# Altium project RFMC.PrjPcb (part 1 of 2)
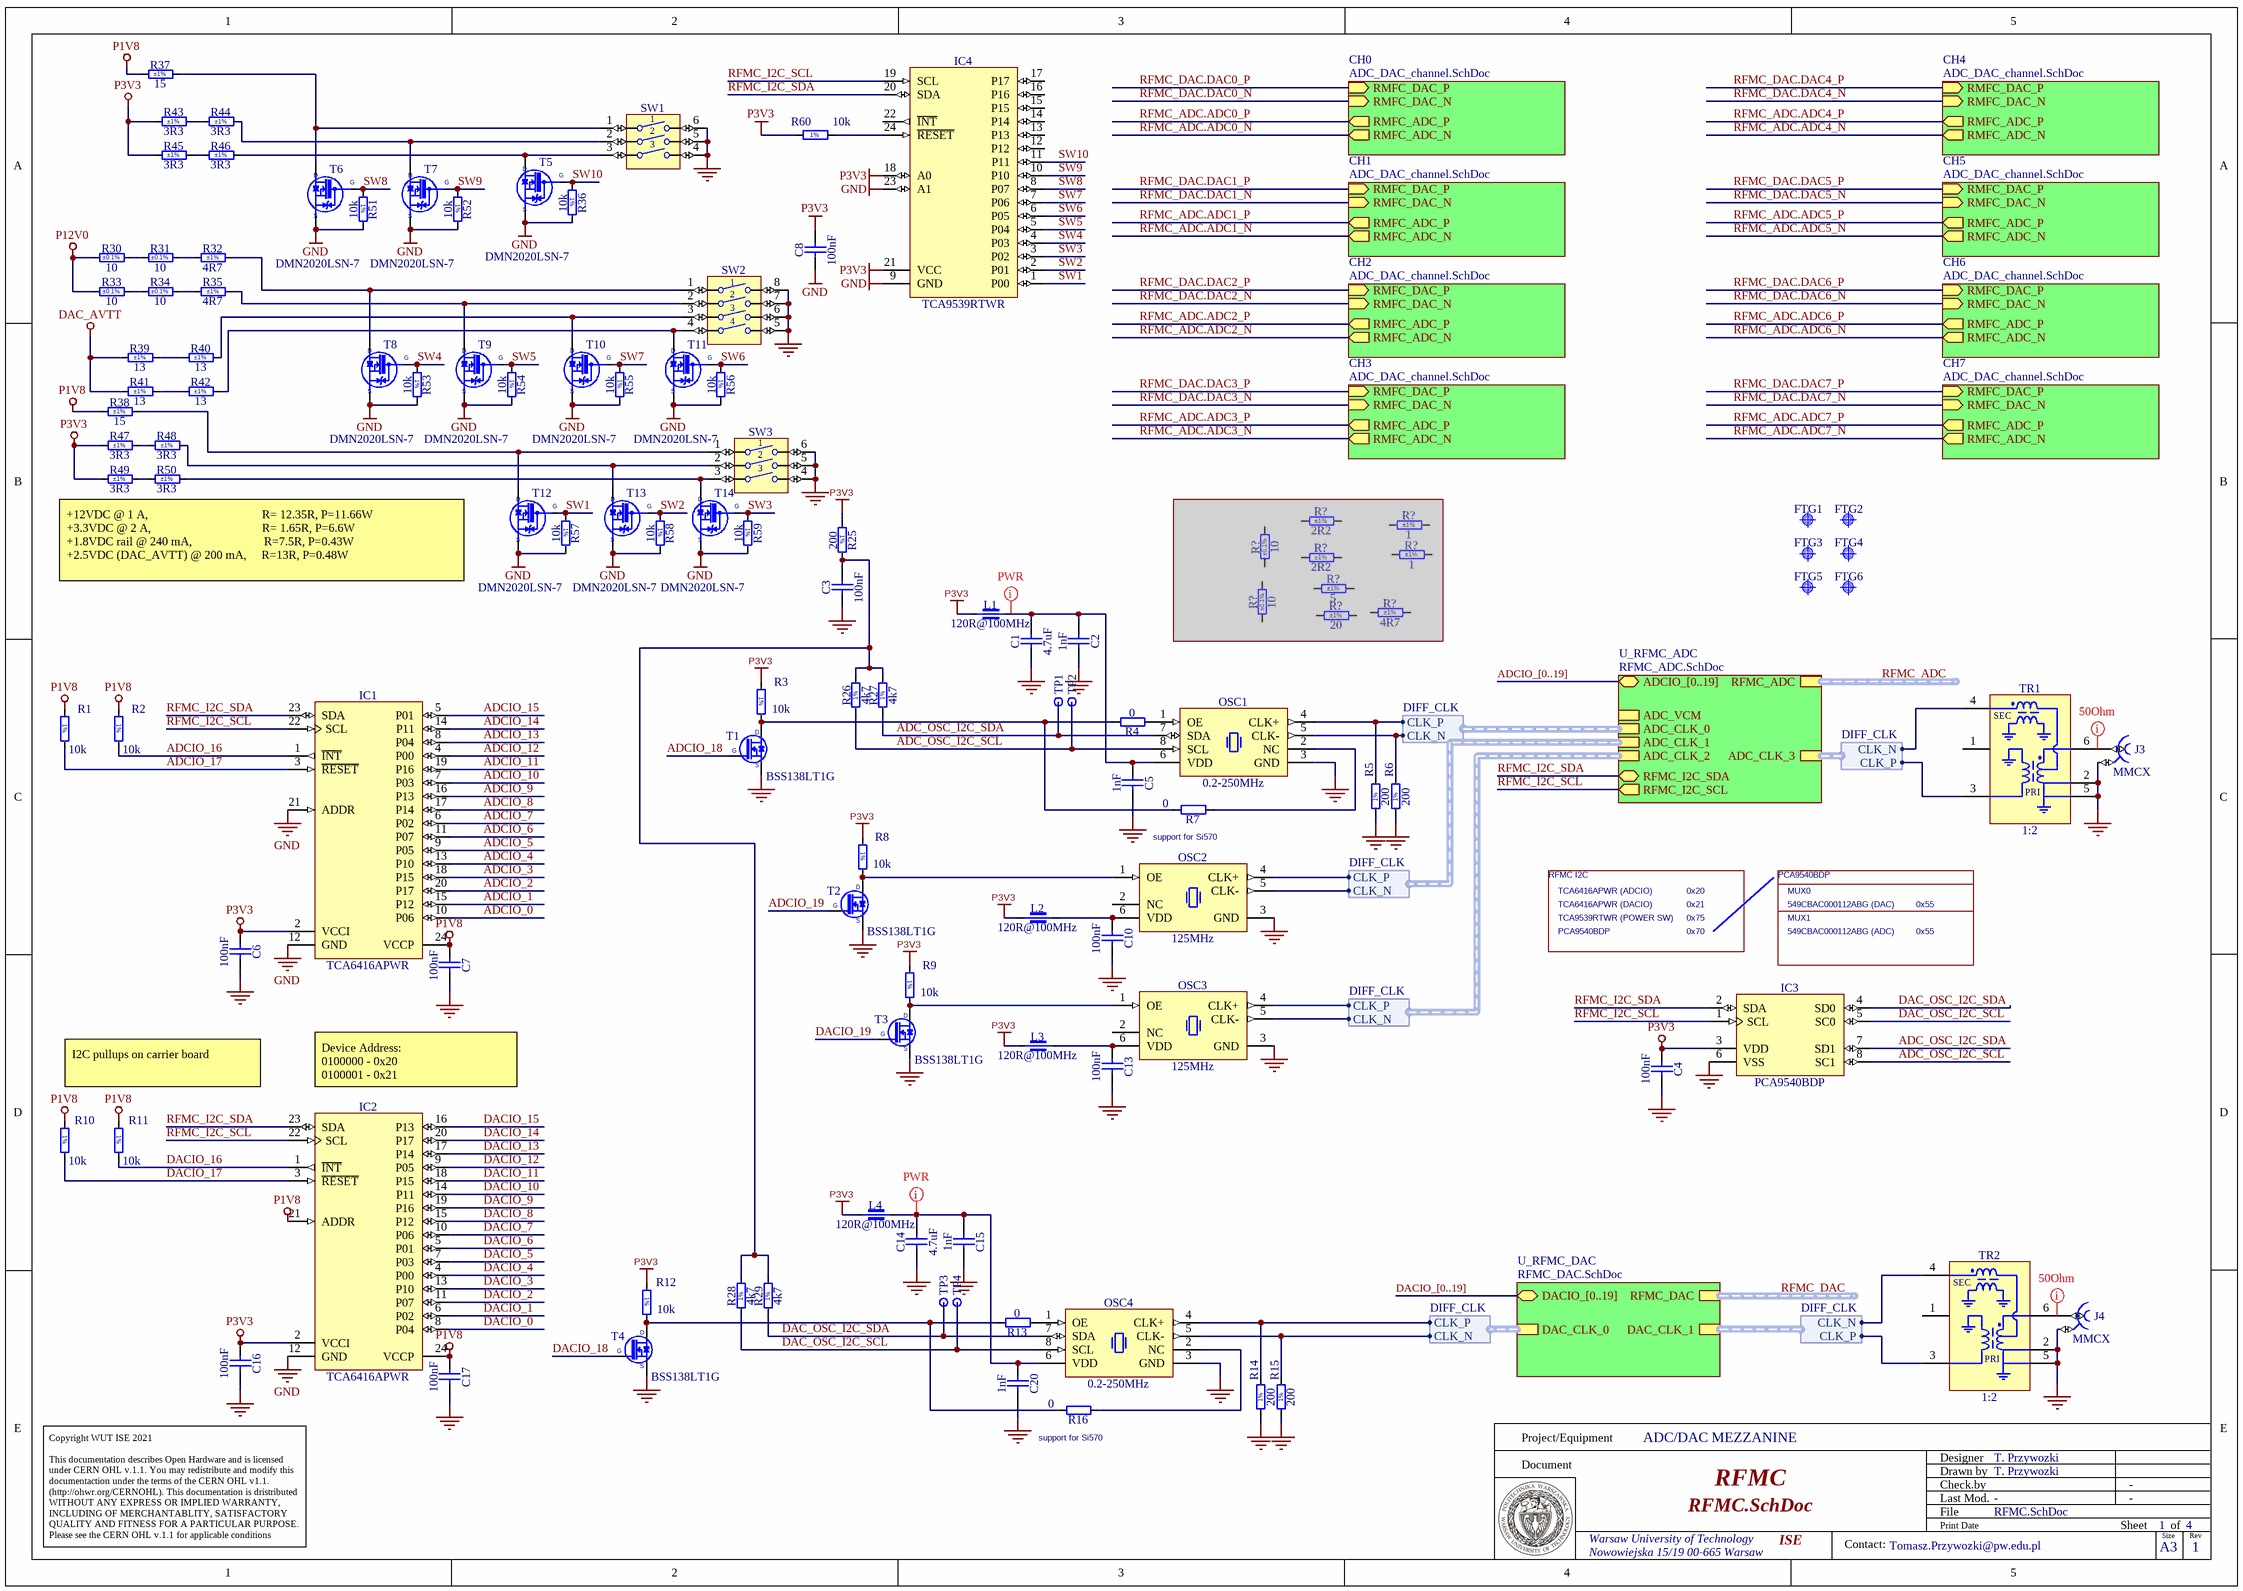
[diagram p0: RFMC.SchDoc]
4 sheets, 304 parts. Net scope: hierarchical (ports join the sheet entries above them; power ports are global).
Board file: RFMC.PcbDoc
Sheets:
  RFMC.SchDoc
    U_RFMC_ADC = RFMC_ADC.SchDoc
    U_RFMC_DAC = RFMC_DAC.SchDoc
    CH0 = ADC_DAC_channel.SchDoc
    CH1 = ADC_DAC_channel.SchDoc
    CH2 = ADC_DAC_channel.SchDoc
    CH3 = ADC_DAC_channel.SchDoc
    CH4 = ADC_DAC_channel.SchDoc
    CH5 = ADC_DAC_channel.SchDoc
    CH6 = ADC_DAC_channel.SchDoc
    CH7 = ADC_DAC_channel.SchDoc

## Sheet RFMC.SchDoc: RFMC
size 420 x 297 mm; Author: T. Przywozki; CompanyName: WUT; DrawnBy: T. Przywozki; Organization: WUT ISE; Address1: Warsaw University of Technology; Address2: Nowowiejska 15/19 00-665 Warsaw; Address3: Tomasz.Przywozki@pw.edu.pl; Revision: 1; SheetNumber: 1; SheetTotal: 4; Project: RFMC; ModifiedBy: -; CheckedDate: -; Title2: Title2; DivGrp: ISE; Designer: T. Przywozki; ModifiedDate: -; ProjectName: ADC/DAC MEZZANINE

### Parts
(Parts that share a designator on the sheet are numbered #1, #2 ... from top to bottom, then left to right.)
C1  4.7uF  [CAPC1608X90N]
C2  1nF  [CAPC0603X33N]
C3  100nF  [CAPC0603X33N]
C4  100nF  [CAPC0603X33N]
C5  1nF  [CAPC0603X33N]
C6  100nF  [CAPC0603X33N]
C7  100nF  [CAPC0603X33N]
C8  100nF  [CAPC1005X55N]
C10  100nF  [CAPC0603X33N]
C13  100nF  [CAPC0603X33N]
C14  4.7uF  [CAPC1608X90N]
C15  1nF  [CAPC0603X33N]
C16  100nF  [CAPC0603X33N]
C17  100nF  [CAPC0603X33N]
C20  1nF  [CAPC0603X33N]
FTG1  Use only in PCB  [FIDUCIAL_TOP_C100-200]  (value not drawn)
FTG2  Use only in PCB  [FIDUCIAL_TOP_S100-200]  (value not drawn)
FTG3  Use only in PCB  [FIDUCIAL_TOP_C100-200]  (value not drawn)
FTG4  Use only in PCB  [FIDUCIAL_TOP_S100-200]  (value not drawn)
FTG5  Use only in PCB  [FIDUCIAL_TOP_C100-200]  (value not drawn)
FTG6  Use only in PCB  [FIDUCIAL_TOP_S100-200]  (value not drawn)
IC1  TCA6416APWR  [SOP65P640X120-24N]
IC2  TCA6416APWR  [SOP65P640X120-24N]
IC3  PCA9540BDP  [SOP65P490X110-8N]
IC4  TCA9539RTWR  [QFN50P400X400X80-25N-S255]
J3  Family: MMCX  [HUBER-SUHNER_85_MMCX-50-0-1/111_OE]  (hidden comment: Coax_1Female_1Shield)
J4  Family: MMCX  [HUBER-SUHNER_85_MMCX-50-0-1/111_OE]  (hidden comment: Coax_1Female_1Shield)
L1  120R@100MHz  [INDC1608X95N]
L2  120R@100MHz  [INDC1608X95N]
L3  120R@100MHz  [INDC1608X95N]
L4  120R@100MHz  [INDC1608X95N]
OSC1  0.2-250MHz  [OSC_SILICON-LAB_SI549-A]
OSC2  125MHz  [OSC_SILICON-LAB_SI511-6N(3.2X5)]
OSC3  125MHz  [OSC_SILICON-LAB_SI511-6N(3.2X5)]
OSC4  0.2-250MHz  [OSC_SILICON-LAB_SI549-A]
R1  10k  [RESC1005X40N]
R2  10k  [RESC1005X40N]
R3  10k  [RESC1005X40N]
R4  0  [RESC1005X40N]
R5  200  [RESC1005X40N]
R6  200  [RESC1005X40N]
R7  0  [RESC1005X40N]
R8  10k  [RESC1005X40N]
R9  10k  [RESC1005X40N]
R10  10k  [RESC1005X40N]
R11  10k  [RESC1005X40N]
R12  10k  [RESC1005X40N]
R13  0  [RESC1005X40N]
R14  200  [RESC1005X40N]
R15  200  [RESC1005X40N]
R16  0  [RESC1005X40N]
R25  200  [RESC1005X40N]
R26  4k7  [RESC1005X40N]
R27  4k7  [RESC1005X40N]
R28  4k7  [RESC1005X40N]
R29  4k7  [RESC1005X40N]
R30  10  Tolerance: ±0.1%  [RESC6531X85N]
R31  10  Tolerance: ±0.1%  [RESC6531X85N]
R32  4R7  Tolerance: ±1%  [RESC6432X120N]
R33  10  Tolerance: ±0.1%  [RESC6531X85N]
R34  10  Tolerance: ±0.1%  [RESC6531X85N]
R35  4R7  Tolerance: ±1%  [RESC6432X120N]
R36  10k  [RESC1005X40N]
R37  15  Tolerance: ±1%  [RESC3216X65N]
R38  15  Tolerance: ±1%  [RESC3216X65N]
R39  13  Tolerance: ±1%  [RESC3216X65N]
R40  13  Tolerance: ±1%  [RESC3216X65N]
R41  13  Tolerance: ±1%  [RESC3216X65N]
R42  13  Tolerance: ±1%  [RESC3216X65N]
R43  3R3  Tolerance: ±1%  [RESC6331X70N]
R44  3R3  Tolerance: ±1%  [RESC6331X70N]
R45  3R3  Tolerance: ±1%  [RESC6331X70N]
R46  3R3  Tolerance: ±1%  [RESC6331X70N]
R47  3R3  Tolerance: ±1%  [RESC6331X70N]
R48  3R3  Tolerance: ±1%  [RESC6331X70N]
R49  3R3  Tolerance: ±1%  [RESC6331X70N]
R50  3R3  Tolerance: ±1%  [RESC6331X70N]
R51  10k  [RESC1005X40N]
R52  10k  [RESC1005X40N]
R53  10k  [RESC1005X40N]
R54  10k  [RESC1005X40N]
R55  10k  [RESC1005X40N]
R56  10k  [RESC1005X40N]
R57  10k  [RESC1005X40N]
R58  10k  [RESC1005X40N]
R59  10k  [RESC1005X40N]
R60  10k  [RESC1005X40N]
R?#1  2R2  Tolerance: ±1%  [RESC6432X120N]  (masked out: inside a compile mask, not in the netlist)
R?#2  1  Tolerance: ±1%  [RESC6331X70N]  (masked out: inside a compile mask, not in the netlist)
R?#3  1  Tolerance: ±1%  [RESC6331X70N]  (masked out: inside a compile mask, not in the netlist)
R?#4  2R2  Tolerance: ±1%  [RESC6432X120N]  (masked out: inside a compile mask, not in the netlist)
R?#5  10  Tolerance: ±0.1%  [RESC6531X85N]  (masked out: inside a compile mask, not in the netlist)
R?#6  5  Tolerance: ±1%  [RESM11670X449N]  (masked out: inside a compile mask, not in the netlist)
R?#7  20  Tolerance: ±1%  [RESC6432X120N]  (masked out: inside a compile mask, not in the netlist)
R?#8  4R7  Tolerance: ±1%  [RESC6331X70N]  (masked out: inside a compile mask, not in the netlist)
R?#9  10  Tolerance: ±0.1%  [RESC6531X85N]  (masked out: inside a compile mask, not in the netlist)
SW1  Switch  [SW_OMRON_A6SN-3101]  (value not drawn)
SW2  Switch  [SW_OMRON_A6SN-4101]  (value not drawn)
SW3  Switch  [SW_OMRON_A6SN-3101]  (value not drawn)
T1  BSS138LT1G  [SOT95P240X110-3N]
T2  BSS138LT1G  [SOT95P240X110-3N]
T3  BSS138LT1G  [SOT95P240X110-3N]
T4  BSS138LT1G  [SOT95P240X110-3N]
T5  DMN2020LSN-7  [SOT95P285X140-3N]
T6  DMN2020LSN-7  [SOT95P285X140-3N]
T7  DMN2020LSN-7  [SOT95P285X140-3N]
T8  DMN2020LSN-7  [SOT95P285X140-3N]
T9  DMN2020LSN-7  [SOT95P285X140-3N]
T10  DMN2020LSN-7  [SOT95P285X140-3N]
T11  DMN2020LSN-7  [SOT95P285X140-3N]
T12  DMN2020LSN-7  [SOT95P285X140-3N]
T13  DMN2020LSN-7  [SOT95P285X140-3N]
T14  DMN2020LSN-7  [SOT95P285X140-3N]
TP1  Test Point  [TPS127]  (value not drawn)
TP2  Test Point  [TPS127]  (value not drawn)
TP3  Test Point  [TPS127]  (value not drawn)
TP4  Test Point  [TPS127]  (value not drawn)
TR1  1:2  [XFMR_MINI-CIRCUITS_DB1627]
TR2  1:2  [XFMR_MINI-CIRCUITS_DB1627]

### Sub-sheets
CH0 = ADC_DAC_channel.SchDoc: RMFC_DAC_N (in), RMFC_DAC_P (in), RMFC_ADC_P (out), RMFC_ADC_N (out)
CH1 = ADC_DAC_channel.SchDoc: RMFC_DAC_N (in), RMFC_DAC_P (in), RMFC_ADC_P (out), RMFC_ADC_N (out)
CH2 = ADC_DAC_channel.SchDoc: RMFC_DAC_N (in), RMFC_DAC_P (in), RMFC_ADC_P (out), RMFC_ADC_N (out)
CH3 = ADC_DAC_channel.SchDoc: RMFC_DAC_N (in), RMFC_DAC_P (in), RMFC_ADC_P (out), RMFC_ADC_N (out)
CH4 = ADC_DAC_channel.SchDoc: RMFC_DAC_N (in), RMFC_DAC_P (in), RMFC_ADC_P (out), RMFC_ADC_N (out)
CH5 = ADC_DAC_channel.SchDoc: RMFC_DAC_N (in), RMFC_DAC_P (in), RMFC_ADC_P (out), RMFC_ADC_N (out)
CH6 = ADC_DAC_channel.SchDoc: RMFC_DAC_N (in), RMFC_DAC_P (in), RMFC_ADC_P (out), RMFC_ADC_N (out)
CH7 = ADC_DAC_channel.SchDoc: RMFC_DAC_N (in), RMFC_DAC_P (in), RMFC_ADC_P (out), RMFC_ADC_N (out)
U_RFMC_ADC = RFMC_ADC.SchDoc: RFMC_ADC (harness RF_ADC), ADCIO_[0..19] (bidir), ADC_VCM (harness ADC_VCM), RFMC_I2C_SDA (bidir), RFMC_I2C_SCL (out), ADC_CLK_0 (harness DIFF_CLK), ADC_CLK_3 (harness DIFF_CLK), ADC_CLK_2 (harness DIFF_CLK), ADC_CLK_1 (harness DIFF_CLK)
U_RFMC_DAC = RFMC_DAC.SchDoc: RFMC_DAC (harness RF_DAC), DACIO_[0..19] (bidir), DAC_CLK_1 (harness DIFF_CLK), DAC_CLK_0 (harness DIFF_CLK)

### Harnesses
DIFF_CLK: CLK_P, CLK_N

### Nets
DAC_AVTT: R39.1 R41.1
GND: C1.1 C2.1 C3.1 C4.1 C5.1 C6.1 C7.1 C8.1 C10.1 C13.1 C14.1 C15.1 C16.1 C17.1 C20.1 IC1.12(GND) IC1.21(ADDR) IC2.12(GND) IC3.6(VSS) IC4.9(GND) IC4.23(A1) J3.2 J4.2 OSC1.3(GND) OSC2.3(GND) OSC3.3(GND) OSC4.3(GND) R5.1 R6.1 R14.1 R15.1 R36.2 R51.2 R52.2 R53.2 R54.2 R55.2 R56.2 R57.2 R58.2 R59.2 SW1.4 SW1.5 SW1.6 SW2.5 SW2.6 SW2.7 SW2.8 SW3.4 SW3.5 SW3.6 T1.2(S) T2.2(S) T3.2(S) T4.2(S) T5.2(S) T6.2(S) T7.2(S) T8.2(S) T9.2(S) T10.2(S) T11.2(S) T12.2(S) T13.2(S) T14.2(S) TR1.2(P) TR1.5(GND) TR2.2(P) TR2.5(GND)
P1V8: C7.2 C17.2 IC1.24(VCCP) IC2.21(ADDR) IC2.24(VCCP) R1.1 R2.1 R10.1 R11.1 R37.1 R38.1
P3V3: C4.2 C6.2 C8.2 C16.2 IC1.2(VCCI) IC2.2(VCCI) IC3.3(VDD) IC4.18(A0) IC4.21(VCC) L1.1 L2.1 L3.1 L4.1 R3.1 R8.1 R9.1 R12.1 R25.1 R43.1 R45.1 R47.1 R49.1 R60.1
P12V0: R30.1 R33.1
ADC_OSC_I2C_SCL: IC3.8(SC1) OSC1.8(SCL) R26.1 TP2.1
ADC_OSC_I2C_SDA: IC3.7(SD1) OSC1.7(SDA) R27.1 TP1.1
ADCIO_0: IC1.10(P06)
ADCIO_1: IC1.15(P12)
ADCIO_2: IC1.20(P17)
ADCIO_3: IC1.18(P15)
ADCIO_4: IC1.13(P10)
ADCIO_5: IC1.9(P05)
ADCIO_6: IC1.11(P07)
ADCIO_7: IC1.6(P02)
ADCIO_8: IC1.17(P14)
ADCIO_9: IC1.16(P13)
ADCIO_10: IC1.7(P03)
ADCIO_11: IC1.19(P16)
ADCIO_12: IC1.4(P00)
ADCIO_13: IC1.8(P04)
ADCIO_14: IC1.14(P11)
ADCIO_15: IC1.5(P01)
ADCIO_16: IC1.1(~{INT}) R2.2
ADCIO_17: IC1.3(~{RESET}) R1.2
ADCIO_18: T1.1(G)
ADCIO_19: T2.1(G)
ADCLK0_N: OSC1.5(CLK-) R6.2 ; sheet U_RFMC_ADC/ADC_CLK_0.CLK_N
ADCLK0_P: OSC1.4(CLK+) R5.2 ; sheet U_RFMC_ADC/ADC_CLK_0.CLK_P
ADCLK1_N: OSC2.5(CLK-) ; sheet U_RFMC_ADC/ADC_CLK_1.CLK_N
ADCLK1_P: OSC2.4(CLK+) ; sheet U_RFMC_ADC/ADC_CLK_1.CLK_P
ADCLK2_N: OSC3.5(CLK-) ; sheet U_RFMC_ADC/ADC_CLK_2.CLK_N
ADCLK2_P: OSC3.4(CLK+) ; sheet U_RFMC_ADC/ADC_CLK_2.CLK_P
ADCLK3_N: TR1.4(SD) ; sheet U_RFMC_ADC/ADC_CLK_3.CLK_N
ADCLK3_P: TR1.3(S) ; sheet U_RFMC_ADC/ADC_CLK_3.CLK_P
DAC_OSC_I2C_SCL: IC3.5(SC0) OSC4.8(SCL) R28.1 TP4.1
DAC_OSC_I2C_SDA: IC3.4(SD0) OSC4.7(SDA) R29.1 TP3.1
DACIO_0: IC2.8(P04)
DACIO_1: IC2.6(P02)
DACIO_2: IC2.11(P07)
DACIO_3: IC2.13(P10)
DACIO_4: IC2.4(P00)
DACIO_5: IC2.7(P03)
DACIO_6: IC2.5(P01)
DACIO_7: IC2.10(P06)
DACIO_8: IC2.15(P12)
DACIO_9: IC2.19(P16)
DACIO_10: IC2.14(P11)
DACIO_11: IC2.18(P15)
DACIO_12: IC2.9(P05)
DACIO_13: IC2.17(P14)
DACIO_14: IC2.20(P17)
DACIO_15: IC2.16(P13)
DACIO_16: IC2.1(~{INT}) R11.2
DACIO_17: IC2.3(~{RESET}) R10.2
DACIO_18: T4.1(G)
DACIO_19: T3.1(G)
DACLK_IN0_N: OSC4.5(CLK-) R15.2 ; sheet U_RFMC_DAC/DAC_CLK_0.CLK_N
DACLK_IN0_P: OSC4.4(CLK+) R14.2 ; sheet U_RFMC_DAC/DAC_CLK_0.CLK_P
DACLK_IN1_N: TR2.4(SD) ; sheet U_RFMC_DAC/DAC_CLK_1.CLK_N
DACLK_IN1_P: TR2.3(S) ; sheet U_RFMC_DAC/DAC_CLK_1.CLK_P
RFMC_I2C_SCL: IC1.22(SCL) IC2.22(SCL) IC3.1(SCL) IC4.19(SCL) ; sheet U_RFMC_ADC/RFMC_I2C_SCL
RFMC_I2C_SDA: IC1.23(SDA) IC2.23(SDA) IC3.2(SDA) IC4.20(SDA) ; sheet U_RFMC_ADC/RFMC_I2C_SDA
SW1: IC4.1(P00) R57.1 T12.1(G)
SW2: IC4.2(P01) R58.1 T13.1(G)
SW3: IC4.3(P02) R59.1 T14.1(G)
SW4: IC4.4(P03) R53.1 T8.1(G)
SW5: IC4.5(P04) R54.1 T9.1(G)
SW6: IC4.6(P05) R56.1 T11.1(G)
SW7: IC4.7(P06) R55.1 T10.1(G)
SW8: IC4.8(P07) R51.1 T6.1(G)
SW9: IC4.10(P10) R52.1 T7.1(G)
SW10: IC4.11(P11) R36.1 T5.1(G)
NetC1_2: C1.2 C2.2 C5.2 L1.2 OSC1.6(VDD)
NetC3_2: C3.2 R25.2 R26.2 R27.2 R28.2 R29.2
NetC10_2: C10.2 L2.2 OSC2.6(VDD)
NetC13_2: C13.2 L3.2 OSC3.6(VDD)
NetC14_2: C14.2 C15.2 C20.2 L4.2 OSC4.6(VDD)
NetIC4_24: IC4.24(~{RESET}) R60.2
NetJ3_1: J3.1 TR1.6(P1)
NetJ4_1: J4.1 TR2.6(P1)
NetOSC1_1: OSC1.1(OE) R4.1
NetOSC1_2: OSC1.2(NC) R7.1
NetOSC2_1: OSC2.1(OE) R8.2 T2.3(D)
NetOSC3_1: OSC3.1(OE) R9.2 T3.3(D)
NetOSC4_1: OSC4.1(OE) R13.1
NetOSC4_2: OSC4.2(NC) R16.1
NetR3_2: R3.2 R4.2 R7.2 T1.3(D)
NetR12_2: R12.2 R13.2 R16.2 T4.3(D)
NetR30_2: R30.2 R31.1
NetR31_2: R31.2 R32.1
NetR32_2: R32.2 SW2.1 T8.3(D)
NetR33_2: R33.2 R34.1
NetR34_2: R34.2 R35.1
NetR35_2: R35.2 SW2.2 T9.3(D)
NetR37_2: R37.2 SW1.1 T6.3(D)
NetR38_2: R38.2 SW3.1 T12.3(D)
NetR39_2: R39.2 R40.1
NetR40_2: R40.2 SW2.3 T10.3(D)
NetR41_2: R41.2 R42.1
NetR42_2: R42.2 SW2.4 T11.3(D)
NetR43_2: R43.2 R44.1
NetR44_2: R44.2 SW1.2 T7.3(D)
NetR45_2: R45.2 R46.1
NetR46_2: R46.2 SW1.3 T5.3(D)
NetR47_2: R47.2 R48.1
NetR48_2: R48.2 SW3.2 T13.3(D)
NetR49_2: R49.2 R50.1
NetR50_2: R50.2 SW3.3 T14.3(D)

Not connected (* = marked no-connect by the designer): IC4 12(P12) 13(P13) 14(P14) 15(P15) 16(P16) 17(P17) 22(~{INT}); OSC2 2(NC); OSC3 2(NC); TR1 1(NC); TR2 1(NC)

### Buses and harness runs
bus ADCIO_[0..19] = sheet U_RFMC_ADC/ADCIO_[0..19]
bus DACIO_[0..19] = sheet U_RFMC_DAC/DACIO_[0..19]
harness RFMC_ADC = sheet U_RFMC_ADC/RFMC_ADC
harness RFMC_DAC = sheet U_RFMC_DAC/RFMC_DAC

### Layout directives
net class PWR: NetC1_2, NetC14_2
net class SE50: NetJ3_1, NetJ4_1

### Notes on the sheet
- +12VDC @ 1 A,                                      R= 12.35R, P=11.66W
  +3.3VDC @ 2 A,                                     R= 1.65R, P=6.6W
  +1.8VDC rail @ 240 mA,                        R=7.5R, P=0.43W
  +2.5VDC (DAC_AVTT) @ 200 mA,     R=13R, P=0.48W
- support for Si570
- RFMC I2C
- TCA6416APWR (ADCIO)
- TCA6416APWR (DACIO)
- TCA9539RTWR (POWER SW)
- PCA9540BDP
- 0x20
- 0x21
- 0x75
- 0x70
- MUX0
- 549CBAC000112ABG (DAC)
- MUX1
- 549CBAC000112ABG (ADC)
- 0x55
- I2C pullups on carrier board
- Device Address:
  0100000 - 0x20
  0100001 - 0x21
- (near R16) support for Si570
- Project/Equipment
- Document
- Designer
- Drawn by
- Check.by
- Copyright WUT ISE 2021
  This documentation describes Open Hardware and is licensed under CERN OHL v.1.1. You may redistribute and modify this documentaction under the terms of the CERN OHL v1.1.
  (http://ohwr.org/CERNOHL). This documentation is dristributed WITHOUT ANY EXPRESS OR IMPLIED WARRANTY, INCLUDING OF MERCHANTABLITY, SATISFACTORY QUALITY AND FITNESS FOR A PARTICULAR PURPOSE. Please see the CERN OHL v.1.1 for applicable conditions
- File
- Last Mod.
- Print Date
- Sheet
- Size
- A3
- of
- Rev
- Contact:
- (in symbol R0402_4K7_1%_0.0625W_100PPM) 1%
- (in symbol R0402_10K_1%_0.0625W_100PPM) 1%
- (in symbol R0402_200R_1%_0.0625W_100PPM) 1%
- (in symbol XFMR_MINI-CIRCUITS_TCM2-33WX+) SEC; PRI

### Library data of the parts
C1 C14 = CC0603_4.7UF_25V_10%_X5R: Non-polarised capacitor; Manufacturer: GENERIC; Part Description: SMD Multilayer Chip Ceramic Capacitor; Manufacturer1 Part Number: GRM188R61E475KE11D; Tolerance: ±10%; Voltage: 25V; TC: X5R; Manufacturer Part Number: CC0603_4.7UF_25V_10%_X5R; Part Number: CC0603_4.7UF_25V_10%_X5R; Value: 4.7uF; Component Kind: Standard; Component Type: Standard; Pin Count: 2; Status: None; Case: 0603; Mounted: Yes; Socket: No; SMD: Yes; Sense: No; Manufacturer1 Example: MURATA; Manufacturer1 ComponentHeight: 0.95mm; HelpURL: \\cern.ch\dfs\Applications\Altium\Datasheets\CC0603_MURATA_GRM188R61E475KE11D.pdf; Author: CERN DEM JLC; CreateDate: 10.11.2014; LatestRevisionDate: 10.11.2014
C2 C5 C15 C20 = CC0201_1NF_16V_10%_X5R: Non-polarised capacitor; Manufacturer: GENERIC; Part Description: SMD Multilayer Chip Ceramic Capacitor; Manufacturer1 Part Number: 0201YD102KAT2A; Tolerance: ±10%; Voltage: 16V; TC: X5R; Manufacturer Part Number: CC0201_1NF_16V_10%_X5R; Part Number: CC0201_1NF_16V_10%_X5R; Value: 1nF; Component Kind: Standard; Component Type: Standard; Pin Count: 2; Status: Not Recommended; Case: 0201; Mounted: Yes; Socket: No; SMD: Yes; Sense: No; Manufacturer1 Example: AVX; Manufacturer1 ComponentHeight: 0.33mm; HelpURL: \\cern.ch\dfs\Applications\Altium\Datasheets\CC0201_X5R_AVX.pdf; Author: CERN DEM JLC; CreateDate: 03.12.2007; LatestRevisionDate: 03.12.2007
C3 C4 C6 C7 C10 C13 C16 C17 = CC0201_100NF_6.3V_10%_X5R: Non-polarised capacitor; Manufacturer: GENERIC; Part Description: SMD Multilayer Chip Ceramic Capacitor; Manufacturer1 Part Number: 02016D104KAT2A; Tolerance: ±10%; Voltage: 6.3V; TC: X5R; Manufacturer Part Number: CC0201_100NF_6.3V_10%_X5R; Part Number: CC0201_100NF_6.3V_10%_X5R; Value: 100nF; Component Kind: Standard; Component Type: Standard; Pin Count: 2; Status: Not Recommended; Case: 0201; Mounted: Yes; Socket: No; SMD: Yes; Sense: No; Manufacturer1 Example: AVX; Manufacturer1 ComponentHeight: 0.33mm; HelpURL: \\cern.ch\dfs\Applications\Altium\Datasheets\CC0201_X5R_AVX.pdf; Author: CERN DEM JLC; CreateDate: 03.12.2007; LatestRevisionDate: 03.12.2007
C8 = CC0402_100NF_16V_10%_X5R: Non-polarised capacitor; Part Description: SMD Multilayer Chip Ceramic Capacitor; Manufacturer: GENERIC; Manufacturer1 Part Number: GRM155R61C104KA88D; Voltage: 16V; TC: X5R; Tolerance: ±10%; Part Number: CC0402_100NF_16V_10%_X5R; Component Kind: Standard; Component Type: Standard; Pin Count: 2; Value: 100nF; Status: None; Manufacturer Part Number: CC0402_100NF_16V_10%_X5R; Case: 0402; Mounted: Yes; Socket: No; SMD: Yes; Sense: No; Manufacturer1 Example: MURATA; Manufacturer1 ComponentHeight: 0.55mm; HelpURL: \\cern.ch\dfs\Applications\Altium\Datasheets\CC0402_X5R_MURATA_GRM.pdf; Author: CERN DEM JLC; CreateDate: 10.12.2013; LatestRevisionDate: 10.12.2013
FTG1 FTG3 FTG5 = FIDUCIAL_TARGET_C100-200: Fiducial Target; Part Description: Round Fiducial Target, Top Layer, 1.0mm, Top Solder 2.0mm, Keepout =2.0mm; Mounted: No; Part Number: FIDUCIAL_TARGET_C100-200; Component Kind: Standard (No BOM); Component Type: Standard (No BOM); Pin Count: 1; Family: Fiducial; Socket: No; SMD: Yes; Sense: No; Status: None; ComponentHeight: 0mm; HelpURL: Undefined; Author: CERN DEM JLC; CreateDate: 09.02.2010; LatestRevisionDate: 04.04.2012; PackageDescription: Round Fiducial Target, Top Layer, 1.0mm, Top Solder 2.0mm, Keepout =2.0mm
FTG2 FTG4 FTG6 = FIDUCIAL_TARGET_S100-200: Fiducial Target; Part Description: Square Fiducial Target, Top Layer, 1.0mm, Top Solder 2.0mm, Keepout =2.0mm; Mounted: No; Part Number: FIDUCIAL_TARGET_S100-200; Component Kind: Standard (No BOM); Component Type: Standard (No BOM); Pin Count: 1; Family: Fiducial; Socket: No; SMD: Yes; Sense: No; Status: None; ComponentHeight: 0mm; HelpURL: Undefined; Author: CERN DEM JLC; CreateDate: 09.02.2010; LatestRevisionDate: 04.04.2012; PackageDescription: Square Fiducial Target, Top Layer, 1.0mm, Top Solder 2.0mm, Keepout =2.0mm
IC1 IC2 = TCA6416APWR: Low-Voltage 16-Bit I2C and SMBus I/O Expander; Part Description: Low-Voltage 16-Bit I2C and SMBus I/O Expander with Voltage Translation; Manufacturer: TEXAS INSTRUMENTS; PressFit: No; Bonding: No; Part Number: TCA6416APWR; Component Kind: Standard; Component Type: Standard; Device: TCA6416APWR; PackageDescription: SOP, 0.65mm Pitch; 24 Pin, 4.40mm W X 7.80mm L X 1.20mm H body, IPC Medium Density; Manufacturer Part Number: TCA6416APWR; Pin Count: 24; Case: TSSOP24; Mounted: Yes; Socket: No; SMD: Yes; Sense: No; ComponentHeight: 1.2mm; Author: CERN DEM JLC; HelpURL: \\cern.ch\dfs\Applications\Altium\Datasheets\TCA6416APWR.pdf; CreateDate: 08.07.2014; LatestRevisionDate: 26.11.2015
IC3 = PCA9540BDP: 2-Channel I2C-Bus Multiplexer; Manufacturer: NXP SEMICONDUCTORS; PressFit: No; Bonding: No; Part Number: PCA9540BDP; Component Kind: Standard; Component Type: Standard; Device: PCA9540BDP; PackageDescription: SOP, 0.65mm Pitch; 8 Pin, 3.00mm W X 3.00mm L X 1.10mm H body, IPC Medium Density; Part Description: 2-Channel I2C-Bus Multiplexer; Manufacturer Part Number: PCA9540BDP; Pin Count: 8; Case: TSSOP8; Mounted: Yes; Socket: No; SMD: Yes; Sense: No; ComponentHeight: 1.1mm; Author: CERN DEM BC; HelpURL: \\cern.ch\dfs\Applications\Altium\Datasheets\PCA9540BDP.pdf; CreateDate: 16.01.2020; LatestRevisionDate: 16.01.2020
IC4 = TCA9539RTWR: Low-Voltage 16-Bit I2C and SMBus I/O Expander; Part Description: Low Voltage 16-Bit I2C and SMBus Low-Power I/O Expander With Interrupt Output, Reset Pin, Configuration Registers; Manufacturer: TEXAS INSTRUMENTS; PressFit: No; Bonding: No; Part Number: TCA9539RTWR; Component Kind: Standard; Component Type: Standard; Device: TCA9539RTWR; PackageDescription: QFN, 0.50mm Pitch, Square; 24 Pin, 4.00mm X 4.00mm X 0.80mm H Body (w/Thermal Tab 2.55 X 2.55 mm), IPC Medium Density; Manufacturer Part Number: TCA9539RTWR; Pin Count: 25; Case: QFN24; Mounted: Yes; Socket: No; SMD: Yes; Sense: No; ComponentHeight: 0.8mm; Author: CERN DEM MR; HelpURL: \\cern.ch\dfs\Applications\Altium\Datasheets\TCA9539RTWR.pdf; CreateDate: 01.12.2015; LatestRevisionDate: 01.12.2015
J3 J4 = HUBER-SUHNER_85_MMCX-50-0-1/111_OE: Part Description: MMCX 50 Ohms Right Angle PCB Jack; Manufacturer: HUBER+SUHNER; PressFit: No; Part Number: HUBER-SUHNER_85_MMCX-50-0-1/111_OE; Component Kind: Standard; Component Type: Standard; Pin Count: 2; Mounted: Yes; Socket: No; SMD: No; Sense: No; Status: None; Manufacturer Part Number: 85_MMCX-50-0-1/111_OE; ComponentHeight: 9.6mm; HelpURL: \\cern.ch\dfs\Applications\Altium\Datasheets\HUBER-SUHNER_85_MMCX-50-0-1-111_OE.pdf; Author: CERN DEM JLC; CreateDate: 06.11.2014; LatestRevisionDate: 06.11.2014
L1-L4 = IND0603_MURATA_BLM18PG121SN1D: Manufacturer: MURATA; Part Description: SMD EMIFIL Chip Ferrite Bead; Power: 2A; Resistance: 0.05R; Manufacturer Part Number: BLM18PG121SN1D; Part Number: IND0603_MURATA_BLM18PG121SN1D; Value: 120R@100MHz; Component Kind: Standard; Component Type: Standard; Pin Count: 2; Status: None; Case: 0603; Mounted: Yes; Socket: No; SMD: Yes; Sense: No; ComponentHeight: 0.95mm; HelpURL: \\cern.ch\dfs\Applications\Altium\Datasheets\IND0603_MURATA_BLM18P.pdf; Author: CERN DEM BC; CreateDate: 27.07.2015; LatestRevisionDate: 25.10.2018
OSC1 OSC4 = OSC_0.2-250MHZ_SILICON-LAB_549CBAC000112ABG: Any-Rate I2C Programmable XO Oscillator Si549 Series; Part Description: 0.2-250MHz, 1.8V/2.5V/3.3V ±10ppm CMOS , Any-Rate I2C Programmable XO Oscillator Si549 Series; Manufacturer: SILICON LABS; PressFit: No; Bonding: No; Part Number: OSC_0.2-250MHZ_SILICON-LAB_549CBAC000112ABG; Component Kind: Standard; Component Type: Standard; PackageDescription: Oscillator Si549 Series, 8 pins, 5x7mm; Value: 0.2-250MHz; Manufacturer Part Number: 549CBAC000112ABG; Pin Count: 8; Mounted: Yes; Socket: No; SMD: Yes; Sense: No; ComponentHeight: 1.33mm; HelpURL: \\cern.ch\dfs\Applications\Altium\Datasheets\OSC_SILICON-LAB_SI549.pdf; Author: CERN DEM BC; CreateDate: 25.10.2019; LatestRevisionDate: 25.10.2019
OSC2 OSC3 = OSC_125MHZ_SILICON-LAB_511BBA125M000BAGR: Crystal Oscillator 6 pins, Si511 (LVDS/LVPECL/HCSL/Dual CMOS); Part Description: 3.3V, ±50ppm, -40°C to +85°C, LVDS XO Oscillator, Si510 Series; Manufacturer: SILICON LABS; PressFit: No; Bonding: No; Part Number: OSC_125MHZ_SILICON-LAB_511BBA125M000BAGR; Component Kind: Standard; Component Type: Standard; PackageDescription: Oscillator Si510 Series, 6 pins, 3.2x5mm; Value: 125MHz; Manufacturer Part Number: 511BBA125M000BAGR; Pin Count: 6; Mounted: Yes; Socket: No; SMD: Yes; Sense: No; ComponentHeight: 1.28mm; HelpURL: \\cern.ch\dfs\Applications\Altium\Datasheets\OSC_SILICON-LAB_SI511.pdf; Author: CERN DEM JLC; CreateDate: 26.11.2018; LatestRevisionDate: 26.11.2018
R1-R3 R8-R12 R60 = R0402_10K_1%_0.0625W_100PPM: Resistor - 1%; Manufacturer: GENERIC; Part Description: General Purpose Thick Film Chip Resistor; Manufacturer1 Part Number: 232270671003L; TC: ±100ppm/°C; PressFit: No; Manufacturer Part Number: R0402_10K_1%_0.0625W_100PPM; Part Number: R0402_10K_1%_0.0625W_100PPM; Tolerance: ±1%; Value: 10k; Component Kind: Standard; Component Type: Standard; Pin Count: 2; Status: Not Recommended; Power: 0.0625W; Case: 0402; Mounted: Yes; Sense: No; Socket: No; SMD: Yes; Manufacturer1 Example: YAGEO PHYCOMP; Manufacturer1 ComponentHeight: 0.4mm; HelpURL: \\cern.ch\dfs\Applications\Altium\Datasheets\R0402_Phycomp_RC0402.pdf; Author: CERN DEM JLC; CreateDate: 03.12.2007; LatestRevisionDate: 17.10.2012
R4 R7 R13 R16 = R0402_0R_JUMPER: Resistor; Manufacturer: GENERIC; Part Description: 1A (0.05R Max DC Resistance) Zero Ohm Jumper; Manufacturer1 Part Number: 232270591001L; PressFit: No; Manufacturer Part Number: R0402_0R_JUMPER; Part Number: R0402_0R_JUMPER; Value: 0; Component Kind: Standard; Component Type: Standard; Pin Count: 2; Status: Not Recommended; Case: 0402; Mounted: Yes; Sense: No; Socket: No; SMD: Yes; Manufacturer1 Example: YAGEO PHYCOMP; Manufacturer1 ComponentHeight: 0.4mm; HelpURL: \\cern.ch\dfs\Applications\Altium\Datasheets\R0402_Phycomp_RC0402.pdf; Author: CERN DEM JLC; CreateDate: 03.12.2007; LatestRevisionDate: 17.10.2012
R5 R6 R14 R15 R25 = R0402_200R_1%_0.0625W_100PPM: Resistor - 1%; Manufacturer: GENERIC; Part Description: General Purpose Thick Film Chip Resistor; Manufacturer1 Part Number: 232270672001L; TC: ±100ppm/°C; PressFit: No; Manufacturer Part Number: R0402_200R_1%_0.0625W_100PPM; Part Number: R0402_200R_1%_0.0625W_100PPM; Tolerance: ±1%; Value: 200; Component Kind: Standard; Component Type: Standard; Pin Count: 2; Status: Not Recommended; Power: 0.0625W; Case: 0402; Mounted: Yes; Sense: No; Socket: No; SMD: Yes; Manufacturer1 Example: YAGEO PHYCOMP; Manufacturer1 ComponentHeight: 0.4mm; HelpURL: \\cern.ch\dfs\Applications\Altium\Datasheets\R0402_Phycomp_RC0402.pdf; Author: CERN DEM JLC; CreateDate: 03.12.2007; LatestRevisionDate: 17.10.2012
R26-R29 = R0402_4K7_1%_0.0625W_100PPM: Resistor - 1%; Manufacturer: GENERIC; Part Description: General Purpose Thick Film Chip Resistor; Manufacturer1 Part Number: 232270674702L; TC: ±100ppm/°C; PressFit: No; Manufacturer Part Number: R0402_4K7_1%_0.0625W_100PPM; Part Number: R0402_4K7_1%_0.0625W_100PPM; Tolerance: ±1%; Value: 4k7; Component Kind: Standard; Component Type: Standard; Pin Count: 2; Status: Not Recommended; Power: 0.0625W; Case: 0402; Mounted: Yes; Sense: No; Socket: No; SMD: Yes; Manufacturer1 Example: YAGEO PHYCOMP; Manufacturer1 ComponentHeight: 0.4mm; HelpURL: \\cern.ch\dfs\Applications\Altium\Datasheets\R0402_Phycomp_RC0402.pdf; Author: CERN DEM JLC; CreateDate: 03.12.2007; LatestRevisionDate: 17.10.2012
R30 R31 R33 R34 R?#5 R?#9 = R2512_10R_0.1%_2.5W_25PPM: Resistor - 0.1%; Part Description: High Power Thin Film Wraparound Chip Resistor; Manufacturer: VISHAY DALE; Manufacturer Part Number: PHP02512E10R0BST3; Power: 2.5W; TC: ±25ppm/°C; PressFit: No; Part Number: R2512_10R_0.1%_2.5W_25PPM; Component Kind: Standard; Component Type: Standard; Pin Count: 2; Value: 10; Status: Not Recommended; Case: 2512; Mounted: Yes; Sense: No; Socket: No; SMD: Yes; ComponentHeight: 0.84mm; HelpURL: \\cern.ch\dfs\Applications\Altium\Datasheets\R2512_VISHAY_PHP.pdf; Author: CERN DEM JLC; CreateDate: 06.06.2017; LatestRevisionDate: 06.06.2017
R32 R35 = R2512_4R7_1%_3W_100PPM_TYCO_3522: Resistor - 1%; Part Description: SMD Power Resistor; Manufacturer: TYCO; Manufacturer Part Number: 1-2176230-0 (35224R7JT); Power: 3W; TC: ±100ppm/°C; PressFit: No; Part Number: R2512_4R7_1%_3W_100PPM_TYCO_3522; Component Kind: Standard; Component Type: Standard; Pin Count: 2; Value: 4R7; Status: None; Case: 2512; Mounted: Yes; Sense: No; Socket: No; SMD: Yes; ComponentHeight: 1.2mm; HelpURL: \\cern.ch\dfs\Applications\Altium\Datasheets\R2512_TYCO_3522.pdf; Author: CERN DEM MR; CreateDate: 09.01.2018; LatestRevisionDate: 09.01.2018
R36 R51-R59 = R0402_10K_1%_0.0625W_100PPM: Resistor - 1%; Part Description: General Purpose Thick Film Chip Resistor; Manufacturer: GENERIC; Manufacturer1 Part Number: 232270671003L; TC: ±100ppm/°C; Part Number: R0402_10K_1%_0.0625W_100PPM; Component Kind: Standard; Component Type: Standard; Pin Count: 2; Value: 10k; Status: Not recommended; Power: 0.0625W; Tolerance: ±1%; Manufacturer Part Number: R0402_10K_1%_0.0625W_100PPM; Case: 0402; Mounted: Yes; Sense: No; Socket: No; SMD: Yes; Manufacturer1 Example: YAGEO PHYCOMP; Manufacturer1 ComponentHeight: 0.4mm; HelpURL: \\cern.ch\dfs\Applications\Altium\Datasheets\R0402_Phycomp_RC0402.pdf; Author: CERN DEM JLC; CreateDate: 03.12.2007; LatestRevisionDate: 17.10.2012
R37 R38 = R1206_15R_1%_0.25W_100PPM: Resistor - 1%; Part Description: General Purpose Thick Film Chip Resistor; Manufacturer: GENERIC; Manufacturer1 Part Number: NRC12F15R0TRF; Power: 0.25W; TC: ±100ppm/°C; PressFit: No; Part Number: R1206_15R_1%_0.25W_100PPM; Component Kind: Standard; Component Type: Standard; Pin Count: 2; Value: 15; Status: Preferred; Manufacturer Part Number: R1206_15R_1%_0.25W_100PPM; Case: 1206; Mounted: Yes; Sense: No; Socket: No; SMD: Yes; Manufacturer1 Example: NIC COMPONENT; Manufacturer1 ComponentHeight: 0.65mm; HelpURL: \\cern.ch\dfs\Applications\Altium\Datasheets\R1206_NIC_NRC.pdf; Author: CERN DEM JLC; CreateDate: 03.12.2007; LatestRevisionDate: 13.03.2008
R39-R42 = R1206_13R_1%_0.25W_100PPM: Resistor - 1%; Part Description: General Purpose Thick Film Chip Resistor; Manufacturer: GENERIC; Manufacturer1 Part Number: NRC12F13R0TRF; Power: 0.25W; TC: ±100ppm/°C; PressFit: No; Part Number: R1206_13R_1%_0.25W_100PPM; Component Kind: Standard; Component Type: Standard; Pin Count: 2; Value: 13; Status: Preferred; Manufacturer Part Number: R1206_13R_1%_0.25W_100PPM; Case: 1206; Mounted: Yes; Sense: No; Socket: No; SMD: Yes; Manufacturer1 Example: NIC COMPONENT; Manufacturer1 ComponentHeight: 0.65mm; HelpURL: \\cern.ch\dfs\Applications\Altium\Datasheets\R1206_NIC_NRC.pdf; Author: CERN DEM JLC; CreateDate: 03.12.2007; LatestRevisionDate: 13.03.2008
R43-R50 = R2512_3R3_1%_1W_200PPM: Resistor - 1%; Part Description: Thick Film Chip Resistor; Manufacturer: GENERIC; Manufacturer1 Part Number: 232276363308L or RC2512FK-073R3L; Power: 1W; TC: ±200ppm/°C; PressFit: No; Part Number: R2512_3R3_1%_1W_200PPM; Component Kind: Standard; Component Type: Standard; Pin Count: 2; Value: 3R3; Status: Preferred; Manufacturer Part Number: R2512_3R3_1%_1W_200PPM; Case: 2512; Mounted: Yes; Sense: No; Socket: No; SMD: Yes; Manufacturer1 Example: YAGEO PHYCOMP; Manufacturer1 ComponentHeight: 0.65mm; HelpURL: \\cern.ch\dfs\Applications\Altium\Datasheets\R2512_Phycomp_RC2512.pdf; Author: CERN DEM JLC; CreateDate: 21.07.2008; LatestRevisionDate: 17.10.2012
R?#1 R?#4 = R2512_2R2_1%_3W_100PPM_TYCO_3522: Resistor - 1%; Part Description: SMD Power Resistor; Manufacturer: TYCO; Manufacturer Part Number: 2176230-6 (35222R2JT); Power: 3W; TC: ±100ppm/°C; PressFit: No; Part Number: R2512_2R2_1%_3W_100PPM_TYCO_3522; Component Kind: Standard; Component Type: Standard; Pin Count: 2; Value: 2R2; Status: None; Case: 2512; Mounted: Yes; Sense: No; Socket: No; SMD: Yes; ComponentHeight: 1.2mm; HelpURL: \\cern.ch\dfs\Applications\Altium\Datasheets\R2512_TYCO_3522.pdf; Author: CERN DEM MR; CreateDate: 09.01.2018; LatestRevisionDate: 09.01.2018
R?#2 R?#3 = R2512_1R_1%_3W_50PPM_SUSUMU_KRL: Resistor - 1%; Part Description: Metal Foil Low Resistance Chip Resistor; Manufacturer: SUSUMU; Manufacturer Part Number: KRL3264E-C-1R00-F; Power: 3W; TC: ±50ppm/°C; PressFit: No; Part Number: R2512_1R_1%_3W_50PPM_SUSUMU_KRL; Component Kind: Standard; Component Type: Standard; Pin Count: 2; Value: 1; Status: None; Case: 2512; Mounted: Yes; Sense: No; Socket: No; SMD: Yes; ComponentHeight: 0.70mm; HelpURL: \\cern.ch\dfs\Applications\Altium\Datasheets\R2512_SUSUMU_KRL.pdf; Author: CERN DEM BC; CreateDate: 12.11.2019; LatestRevisionDate: 12.11.2019
R?#6 = R4527_5R_1%_2W_50PPM: Resistor - 1%; Part Description: Surface Mount Precision Power Wirewound Resistor; Manufacturer: VISHAY DALE; Manufacturer Part Number: WSC45275R000FEA; Power: 2W; TC: ±50ppm/°C; PressFit: No; Part Number: R4527_5R_1%_2W_50PPM; Component Kind: Standard; Component Type: Standard; Pin Count: 2; Value: 5; Status: None; Case: 4527; Mounted: Yes; Sense: No; Socket: No; SMD: Yes; ComponentHeight: 4.49mm; HelpURL: \\cern.ch\dfs\Applications\Altium\Datasheets\R4527_VISHAY_WSC.pdf; Author: CERN DEM JLC; CreateDate: 22.03.2011; LatestRevisionDate: 22.03.2011
R?#7 = R2512_20R_1%_3W_100PPM_TYCO_3522: Resistor - 1%; Part Description: SMD Power Resistor; Manufacturer: TYCO; Manufacturer Part Number: 2176231-8 (352220RFT); Power: 3W; TC: ±100ppm/°C; PressFit: No; Part Number: R2512_20R_1%_3W_100PPM_TYCO_3522; Component Kind: Standard; Component Type: Standard; Pin Count: 2; Value: 20; Status: None; Case: 2512; Mounted: Yes; Sense: No; Socket: No; SMD: Yes; ComponentHeight: 1.2mm; HelpURL: \\cern.ch\dfs\Applications\Altium\Datasheets\R2512_TYCO_3522.pdf; Author: CERN DEM MR; CreateDate: 09.01.2018; LatestRevisionDate: 09.01.2018
R?#8 = R2512_4R7_1%_1W_200PPM: Resistor - 1%; Part Description: Thick Film Chip Resistor; Manufacturer: GENERIC; Manufacturer1 Part Number: 232276364708L or RC2512FK-074R7L; Power: 1W; TC: ±200ppm/°C; PressFit: No; Part Number: R2512_4R7_1%_1W_200PPM; Component Kind: Standard; Component Type: Standard; Pin Count: 2; Value: 4R7; Status: Preferred; Manufacturer Part Number: R2512_4R7_1%_1W_200PPM; Case: 2512; Mounted: Yes; Sense: No; Socket: No; SMD: Yes; Manufacturer1 Example: YAGEO PHYCOMP; Manufacturer1 ComponentHeight: 0.65mm; HelpURL: \\cern.ch\dfs\Applications\Altium\Datasheets\R2512_Phycomp_RC2512.pdf; Author: CERN DEM JLC; CreateDate: 21.07.2008; LatestRevisionDate: 17.10.2012
SW1 SW3 = SW_OMRON_A6SN-3101: 3 Ways SPST DIP Switch; Part Description: 3 Ways SPST Surface-Mounting Slide Switch With Flat Actuator, Contact Rating 25mA 24VDC; Manufacturer: OMRON; PressFit: No; Part Number: SW_OMRON_A6SN-3101; Component Kind: Standard; Component Type: Standard; Pin Count: 6; PackageDescription: Pitch 2.54mm, Body 9.6x7.5, 3 Ways SPST Surface-Mounting Slide Switch With Flat Actuator (A6SN Series); Family: Switch; Mounted: Yes; Socket: No; SMD: Yes; Sense: No; Status: None; Manufacturer Part Number: A6SN-3101; ComponentHeight: 4.6mm; HelpURL: \\cern.ch\dfs\Applications\Altium\Datasheets\SW_OMRON_A6SN-3101.pdf; Author: CERN DEM MR; CreateDate: 04.11.2016; LatestRevisionDate: 04.11.2016
SW2 = SW_OMRON_A6SN-4101: 4 Ways SPST DIP Switch; Part Description: 4 Ways SPST Surface-Mounting Slide Switch With Flat Actuator, Contact Rating 25mA 24VDC; Manufacturer: OMRON; PressFit: No; Part Number: SW_OMRON_A6SN-4101; Component Kind: Standard; Component Type: Standard; Pin Count: 8; PackageDescription: Pitch 2.54mm, Body 12.1x7.5, 4 Ways SPST Surface-Mounting Slide Switch With Flat Actuator (A6SN Series); Family: Switch; Mounted: Yes; Socket: No; SMD: Yes; Sense: No; Status: None; Manufacturer Part Number: A6SN-4101; ComponentHeight: 4.6mm; HelpURL: \\cern.ch\dfs\Applications\Altium\Datasheets\SW_OMRON_A6SN-4101.pdf; Author: CERN DEM MR; CreateDate: 07.12.2016; LatestRevisionDate: 07.12.2016
T1-T4 = BSS138LT1G: N-CHANNEL MOSFET WITH DIODE; Manufacturer: ON SEMICONDUCTOR; Part Description: 50V 200mA N-Channel Enhancement Mode Field-Effect Transistor; PressFit: No; Bonding: No; Manufacturer Part Number: BSS138LT1G; PackageDescription: SOT23 3-Leads, Pitch 0.95mm - Body 1.4x3mm, IPC Medium Density; Part Number: BSS138LT1G; Component Kind: Standard; Component Type: Standard; Device: BSS138LT1G; Pin Count: 3; Case: SOT23-3; Mounted: Yes; Socket: No; SMD: Yes; Sense: No; ComponentHeight: 1.11mm; HelpURL: \\cern.ch\dfs\Applications\Altium\Datasheets\BSS138LT1G.pdf; Author: CERN DEM JLC; CreateDate: 23.03.2009; LatestRevisionDate: 23.03.2009
T5-T14 = DMN2020LSN-7: 20V, 6.9A, N-Channel Enhancement Mode MOSFET; Manufacturer: DIODES INCORPORATED; PressFit: No; Bonding: No; Part Number: DMN2020LSN-7; Component Kind: Standard; Component Type: Standard; Device: DMN2020LSN-7; PackageDescription: SOT23, 0.95mm Pitch; 3 Pin, 1.6mm W X 3mm L X 1.4mm H Body, IPC Medium Density; Part Description: 20V, 6.9A, N-Channel Enhancement Mode MOSFET; Manufacturer Part Number: DMN2020LSN-7; Pin Count: 3; Case: SOT23-3; Mounted: Yes; Socket: No; SMD: Yes; Sense: No; ComponentHeight: 1.15mm; HelpURL: \\cern.ch\dfs\Applications\Altium\Datasheets\DMN2020LSN-7.pdf; Author: CERN DEM JLC; CreateDate: 17.11.2014; LatestRevisionDate: 19.11.2014
TP1-TP4 = SMD_PAD_1.27X1.27MM: Part Description: 1.27mm x 1.27mm PCB Copper Area (SMD Test Point); Mounted: No; Part Number: SMD_PAD_1.27X1.27MM; Component Kind: Standard (No BOM); Component Type: Standard (No BOM); Pin Count: 1; Family: Test Point; Socket: No; SMD: Yes; Sense: No; Status: None; ComponentHeight: 0mm; HelpURL: Undefined; Author: CERN DEM JLC; CreateDate: 12.01.2008; LatestRevisionDate: 12.01.2008; PackageDescription: 1.27mm x 1.27mm PCB Copper Area (SMD Test Point)
TR1 TR2 = XFMR_MINI-CIRCUITS_TCM2-33WX+: 50 OHMS 10 to 3000 MHz RF Transformer; Power: 0.4W; Part Number: XFMR_MINI-CIRCUITS_TCM2-33WX+; Component Kind: Standard; Component Type: Standard; Pin Count: 6; Value: 1:2; Status: None; Part Description: 50 Ohms 10 to 3000MHz RF Transformer; Manufacturer: MINI-CIRCUITS; Manufacturer Part Number: TCM2-33WX+; Mounted: Yes; Socket: No; Sense: No; SMD: Yes; ComponentHeight: 4.06mm; HelpURL: \\cern.ch\dfs\Applications\Altium\Datasheets\XFMR_MINI-CIRCUITS_TCM2-33WX+.pdf; Author: CERN DEM MR; CreateDate: 01.12.2016; LatestRevisionDate: 01.12.2016

## Sheet RFMC_ADC.SchDoc: RFMC
size 420 x 297 mm; Author: T. Przywozki; CompanyName: WUT ISE; DrawnBy: T. Przywozki; Organization: WUT ISE; Address1: Warsaw University of Technology; Address2: Nowowiejska 15/19 00-665 Warsaw; Address3: Tomasz.Przywozki@pw.edu.pl; Revision: 1.0; SheetNumber: 2; SheetTotal: 4; ModifiedBy: -; CheckedDate: -; DivGrp: ISE; Designer: T. Przywozki; Project: RFMC
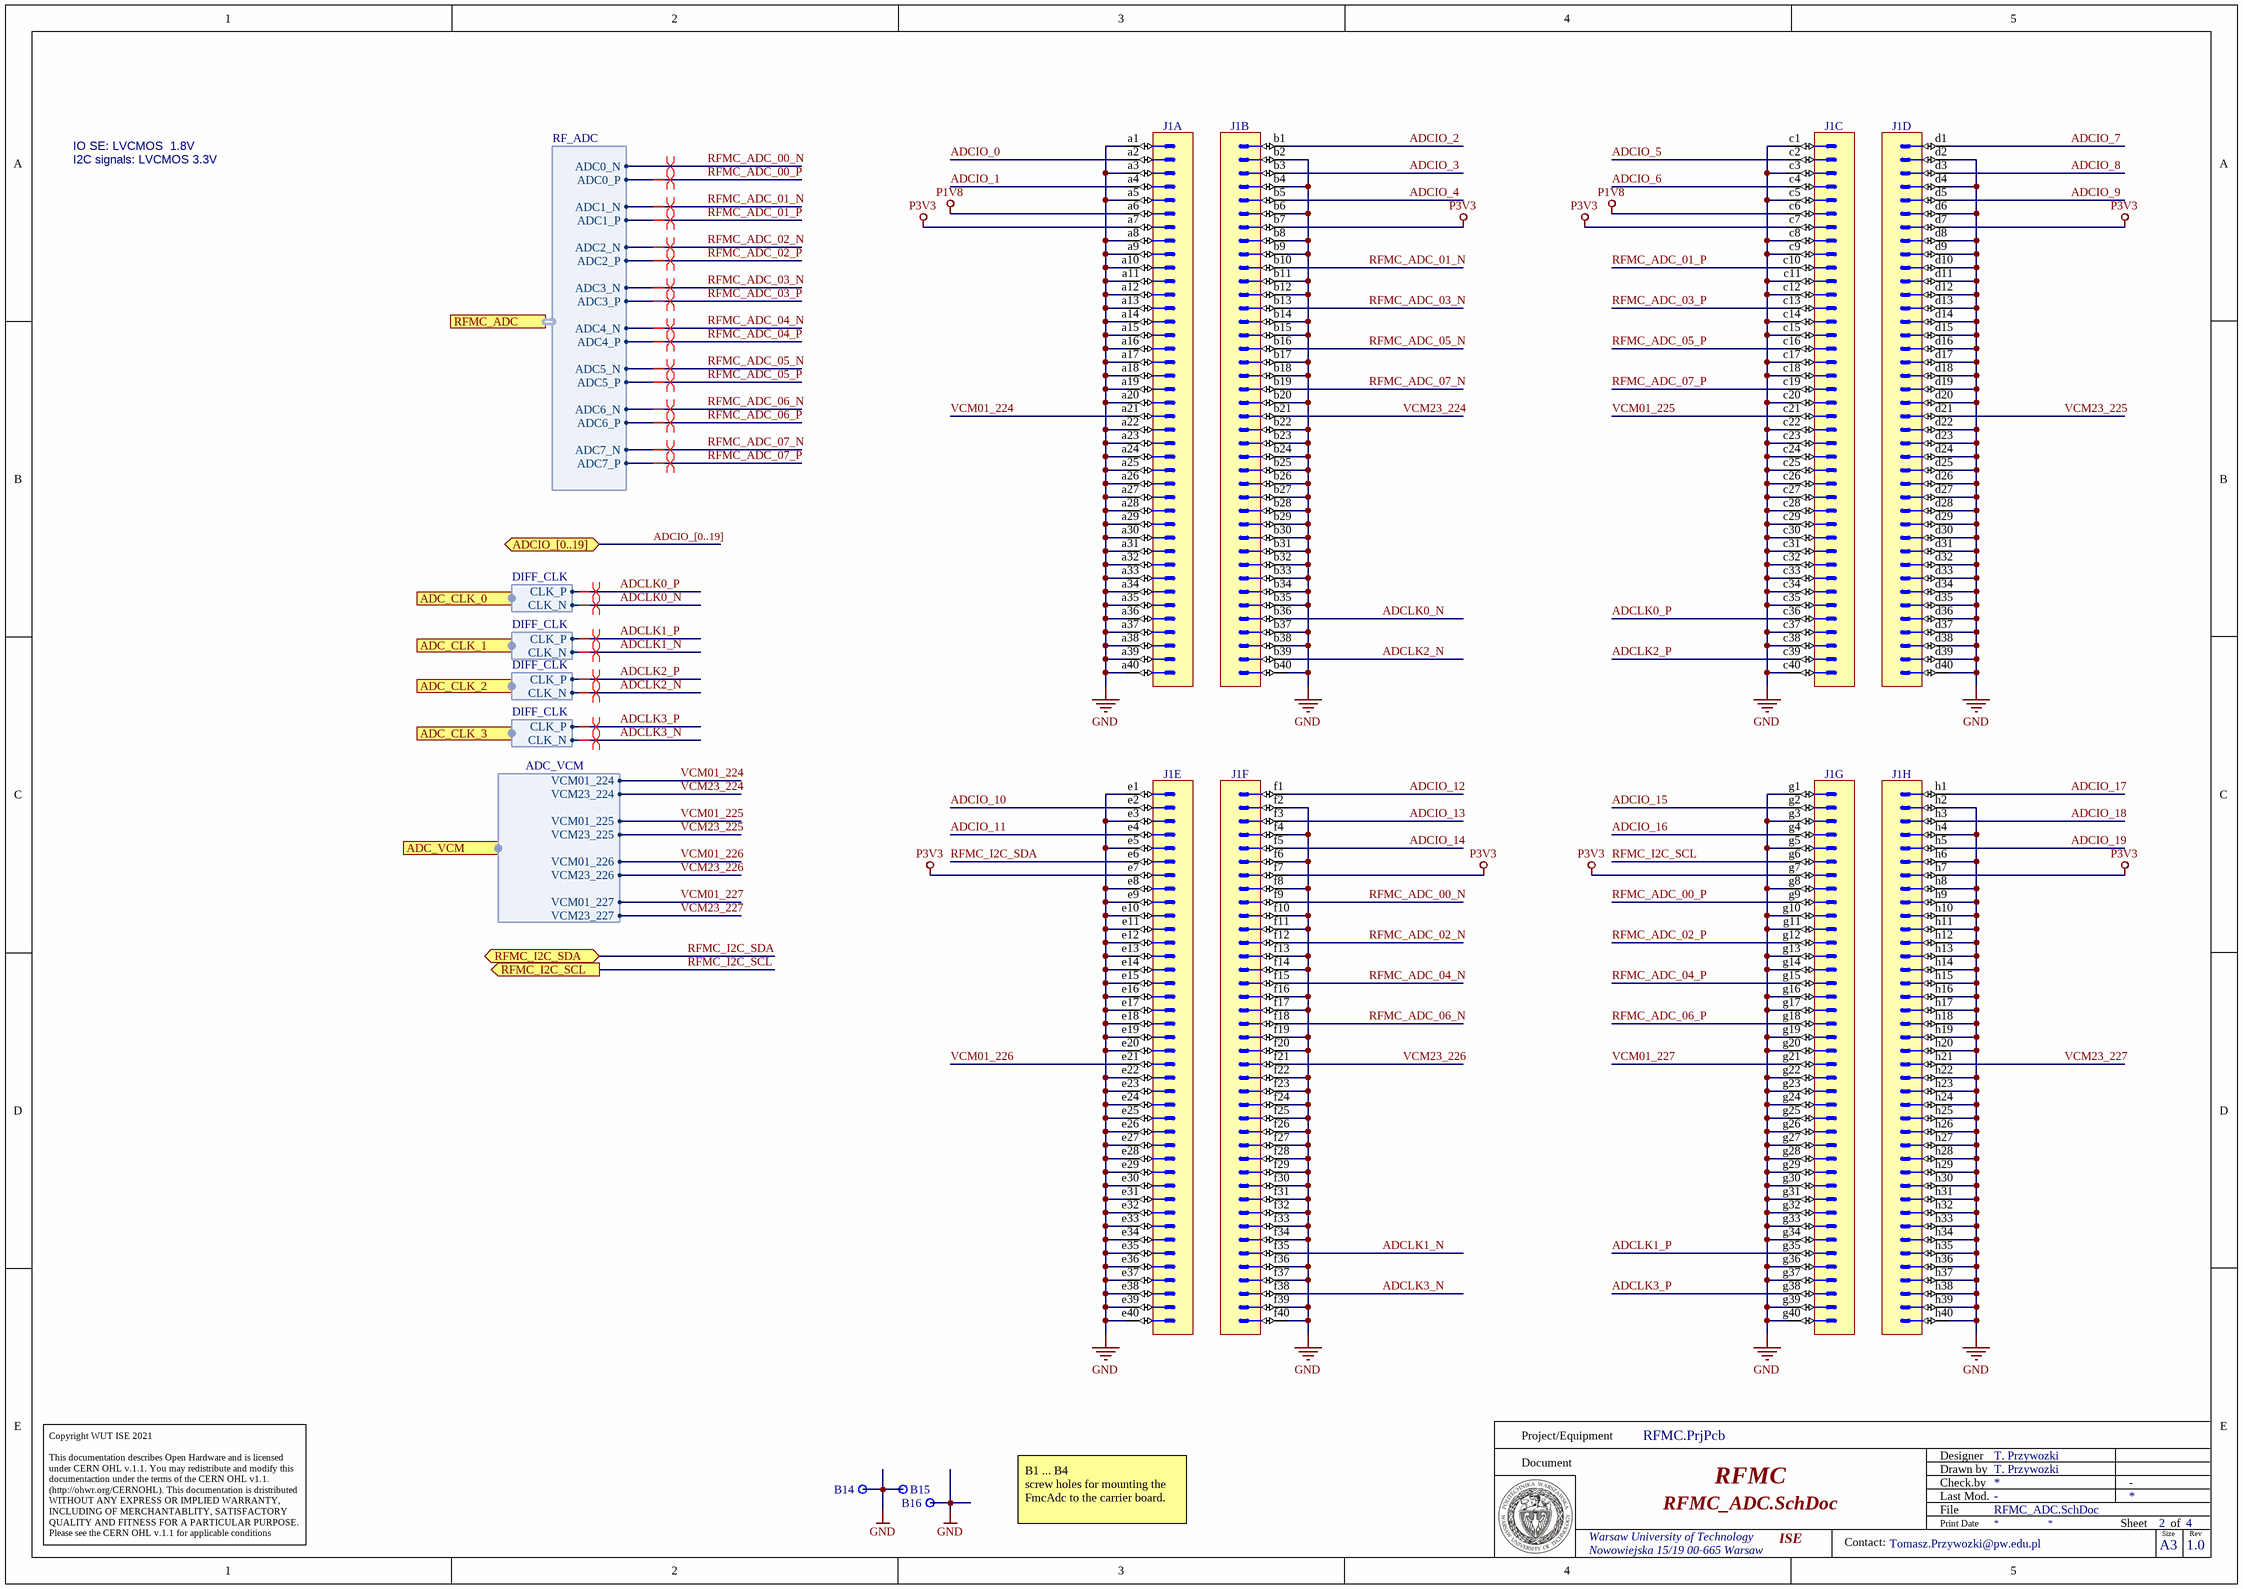
[diagram p1: RFMC_ADC.SchDoc]

### Parts
B14  Plated Hole  [MTG270_500]  (value not drawn)
B15  Plated Hole  [MTG270_500]  (value not drawn)
B16  Plated Hole  [MTG270_500]  (value not drawn)
J1  (no value)  [SAMTEC_LPAM-40-01.0-S-08]  (parts A,B,C,D,E,F,G,H of 8)

### Ports
ADC_CLK_0 (harness DIFF_CLK), ADC_CLK_1 (harness DIFF_CLK), ADC_CLK_2 (harness DIFF_CLK), ADC_CLK_3 (harness DIFF_CLK), ADC_VCM (harness ADC_VCM), ADCIO_[0..19] (bidir), RFMC_ADC (harness RF_ADC), RFMC_I2C_SCL (out), RFMC_I2C_SDA (bidir)

### Harnesses
RF_ADC: ADC0_N, ADC0_P, ADC1_N, ADC1_P, ADC2_N, ADC2_P, ADC3_N, ADC3_P, ADC4_N, ADC4_P, ADC5_N, ADC5_P, ADC6_N, ADC6_P, ADC7_N, ADC7_P
ADC_VCM: VCM01_224, VCM23_224, VCM23_225, VCM01_226, VCM01_227, VCM23_227, VCM01_225, VCM23_226
DIFF_CLK: CLK_P, CLK_N

### Nets
GND: B14.1 B15.1 B16.1 J1.a1 J1.a3 J1.a5 J1.a8 J1.a9 J1.a10 J1.a11 J1.a12 J1.a13 J1.a14 J1.a15 J1.a16 J1.a17 J1.a18 J1.a19 J1.a20 J1.a22 J1.a23 J1.a24 J1.a25 J1.a26 J1.a27 J1.a28 J1.a29 J1.a30 J1.a31 J1.a32 J1.a33 J1.a34 J1.a35 J1.a36 J1.a37 J1.a38 J1.a39 J1.a40 J1.b2 J1.b4 J1.b6 J1.b8 J1.b9 J1.b11 J1.b12 J1.b14 J1.b15 J1.b17 J1.b18 J1.b20 J1.b22 J1.b23 J1.b24 J1.b25 J1.b26 J1.b27 J1.b28 J1.b29 J1.b30 J1.b31 J1.b32 J1.b33 J1.b34 J1.b35 J1.b37 J1.b38 J1.b40 J1.c1 J1.c3 J1.c5 J1.c8 J1.c9 J1.c11 J1.c12 J1.c14 J1.c15 J1.c17 J1.c18 J1.c20 J1.c22 J1.c23 J1.c24 J1.c25 J1.c26 J1.c27 J1.c28 J1.c29 J1.c30 J1.c31 J1.c32 J1.c33 J1.c34 J1.c35 J1.c37 J1.c38 J1.c40 J1.d2 J1.d4 J1.d6 J1.d8 J1.d9 J1.d10 J1.d11 J1.d12 J1.d13 J1.d14 J1.d15 J1.d16 J1.d17 J1.d18 J1.d19 J1.d20 J1.d22 J1.d23 J1.d24 J1.d25 J1.d26 J1.d27 J1.d28 J1.d29 J1.d30 J1.d31 J1.d32 J1.d33 J1.d34 J1.d35 J1.d36 J1.d37 J1.d38 J1.d39 J1.d40 J1.e1 J1.e3 J1.e5 J1.e8 J1.e9 J1.e10 J1.e11 J1.e12 J1.e13 J1.e14 J1.e15 J1.e16 J1.e17 J1.e18 J1.e19 J1.e20 J1.e22 J1.e23 J1.e24 J1.e25 J1.e26 J1.e27 J1.e28 J1.e29 J1.e30 J1.e31 J1.e32 J1.e33 J1.e34 J1.e35 J1.e36 J1.e37 J1.e38 J1.e39 J1.e40 J1.f2 J1.f4 J1.f6 J1.f8 J1.f10 J1.f11 J1.f13 J1.f14 J1.f16 J1.f17 J1.f19 J1.f20 J1.f22 J1.f23 J1.f24 J1.f25 J1.f26 J1.f27 J1.f28 J1.f29 J1.f30 J1.f31 J1.f32 J1.f33 J1.f34 J1.f36 J1.f37 J1.f39 J1.f40 J1.g1 J1.g3 J1.g5 J1.g8 J1.g10 J1.g11 J1.g13 J1.g14 J1.g16 J1.g17 J1.g19 J1.g20 J1.g22 J1.g23 J1.g24 J1.g25 J1.g26 J1.g27 J1.g28 J1.g29 J1.g30 J1.g31 J1.g32 J1.g33 J1.g34 J1.g36 J1.g37 J1.g39 J1.g40 J1.h2 J1.h4 J1.h6 J1.h8 J1.h9 J1.h10 J1.h11 J1.h12 J1.h13 J1.h14 J1.h15 J1.h16 J1.h17 J1.h18 J1.h19 J1.h20 J1.h22 J1.h23 J1.h24 J1.h25 J1.h26 J1.h27 J1.h28 J1.h29 J1.h30 J1.h31 J1.h32 J1.h33 J1.h34 J1.h35 J1.h36 J1.h37 J1.h38 J1.h39 J1.h40
P1V8: J1.a6 J1.c6
P3V3: J1.a7 J1.b7 J1.c7 J1.d7 J1.e7 J1.f7 J1.g7 J1.h7
ADCIO_0: J1.a2
ADCIO_1: J1.a4
ADCIO_2: J1.b1
ADCIO_3: J1.b3
ADCIO_4: J1.b5
ADCIO_5: J1.c2
ADCIO_6: J1.c4
ADCIO_7: J1.d1
ADCIO_8: J1.d3
ADCIO_9: J1.d5
ADCIO_10: J1.e2
ADCIO_11: J1.e4
ADCIO_12: J1.f1
ADCIO_13: J1.f3
ADCIO_14: J1.f5
ADCIO_15: J1.g2
ADCIO_16: J1.g4
ADCIO_17: J1.h1
ADCIO_18: J1.h3
ADCIO_19: J1.h5
ADCLK0_N: J1.b36 ; port ADC_CLK_0.CLK_N
ADCLK0_P: J1.c36 ; port ADC_CLK_0.CLK_P
ADCLK1_N: J1.f35 ; port ADC_CLK_1.CLK_N
ADCLK1_P: J1.g35 ; port ADC_CLK_1.CLK_P
ADCLK2_N: J1.b39 ; port ADC_CLK_2.CLK_N
ADCLK2_P: J1.c39 ; port ADC_CLK_2.CLK_P
ADCLK3_N: J1.f38 ; port ADC_CLK_3.CLK_N
ADCLK3_P: J1.g38 ; port ADC_CLK_3.CLK_P
RFMC_ADC_00_N: J1.f9 ; port RFMC_ADC.ADC0_N  [project net RFMC_ADC.ADC0_N]
RFMC_ADC_00_P: J1.g9 ; port RFMC_ADC.ADC0_P  [project net RFMC_ADC.ADC0_P]
RFMC_ADC_01_N: J1.b10 ; port RFMC_ADC.ADC1_N  [project net RFMC_ADC.ADC1_N]
RFMC_ADC_01_P: J1.c10 ; port RFMC_ADC.ADC1_P  [project net RFMC_ADC.ADC1_P]
RFMC_ADC_02_N: J1.f12 ; port RFMC_ADC.ADC2_N  [project net RFMC_ADC.ADC2_N]
RFMC_ADC_02_P: J1.g12 ; port RFMC_ADC.ADC2_P  [project net RFMC_ADC.ADC2_P]
RFMC_ADC_03_N: J1.b13 ; port RFMC_ADC.ADC3_N  [project net RFMC_ADC.ADC3_N]
RFMC_ADC_03_P: J1.c13 ; port RFMC_ADC.ADC3_P  [project net RFMC_ADC.ADC3_P]
RFMC_ADC_04_N: J1.f15 ; port RFMC_ADC.ADC4_N  [project net RFMC_ADC.ADC4_N]
RFMC_ADC_04_P: J1.g15 ; port RFMC_ADC.ADC4_P  [project net RFMC_ADC.ADC4_P]
RFMC_ADC_05_N: J1.b16 ; port RFMC_ADC.ADC5_N  [project net RFMC_ADC.ADC5_N]
RFMC_ADC_05_P: J1.c16 ; port RFMC_ADC.ADC5_P  [project net RFMC_ADC.ADC5_P]
RFMC_ADC_06_N: J1.f18 ; port RFMC_ADC.ADC6_N  [project net RFMC_ADC.ADC6_N]
RFMC_ADC_06_P: J1.g18 ; port RFMC_ADC.ADC6_P  [project net RFMC_ADC.ADC6_P]
RFMC_ADC_07_N: J1.b19 ; port RFMC_ADC.ADC7_N  [project net RFMC_ADC.ADC7_N]
RFMC_ADC_07_P: J1.c19 ; port RFMC_ADC.ADC7_P  [project net RFMC_ADC.ADC7_P]
RFMC_I2C_SCL: J1.g6 ; port RFMC_I2C_SCL
RFMC_I2C_SDA: J1.e6 ; port RFMC_I2C_SDA
VCM01_224: J1.a21 ; port ADC_VCM.VCM01_224
VCM01_225: J1.c21 ; port ADC_VCM.VCM01_225
VCM01_226: J1.e21 ; port ADC_VCM.VCM01_226
VCM01_227: J1.g21 ; port ADC_VCM.VCM01_227
VCM23_224: J1.b21 ; port ADC_VCM.VCM23_224
VCM23_225: J1.d21 ; port ADC_VCM.VCM23_225
VCM23_226: J1.f21 ; port ADC_VCM.VCM23_226
VCM23_227: J1.h21 ; port ADC_VCM.VCM23_227

### Buses and harness runs
bus ADCIO_[0..19] = port ADCIO_[0..19]

### Layout directives
differential pair; differential pair class Analog: RFMC_ADC.ADC0_N, RFMC_ADC.ADC0_P, RFMC_ADC.ADC1_N, RFMC_ADC.ADC1_P, RFMC_ADC.ADC2_N, RFMC_ADC.ADC2_P, RFMC_ADC.ADC3_N, RFMC_ADC.ADC3_P, RFMC_ADC.ADC4_N, RFMC_ADC.ADC4_P, RFMC_ADC.ADC5_N, RFMC_ADC.ADC5_P, RFMC_ADC.ADC6_N, RFMC_ADC.ADC6_P, RFMC_ADC.ADC7_N, RFMC_ADC.ADC7_P
differential pair: ADCLK0_N, ADCLK0_P, ADCLK1_N, ADCLK1_P, ADCLK2_N, ADCLK2_P, ADCLK3_N, ADCLK3_P

### Notes on the sheet
- I2C signals: LVCMOS 3.3V
- IO SE: LVCMOS  1.8V
- B1 ... B4
  screw holes for mounting the FmcAdc to the carrier board.
- Project/Equipment
- Document
- Designer
- Drawn by
- Check.by
- Copyright WUT ISE 2021
  This documentation describes Open Hardware and is licensed under CERN OHL v.1.1. You may redistribute and modify this documentaction under the terms of the CERN OHL v1.1.
  (http://ohwr.org/CERNOHL). This documentation is dristributed WITHOUT ANY EXPRESS OR IMPLIED WARRANTY, INCLUDING OF MERCHANTABLITY, SATISFACTORY QUALITY AND FITNESS FOR A PARTICULAR PURPOSE. Please see the CERN OHL v.1.1 for applicable conditions
- File
- Last Mod.
- Print Date
- Sheet
- Size
- A3
- of
- Rev
- Contact:

### Library data of the parts
B14-B16 = PLATED_HOLE2.7_PAD5.0: Single Terminal Socket; Part Description: Plated Through Hole: Hole Dia.=2.7mm Pad Dia.=5.0mm; Mounted: No; Part Number: PLATED_HOLE2.7_PAD5.0; Component Kind: Standard (No BOM); Component Type: Standard (No BOM); Pin Count: 1; Family: Plated Hole; Socket: No; SMD: No; Sense: No; Status: None; ComponentHeight: 0mm; HelpURL: Undefined; Author: CERN DEM JMW; CreateDate: 27.09.2011; LatestRevisionDate: 27.09.2011; PackageDescription: Plated Through Hole: Hole Dia.=2.7mm Pad Dia.=5.0mm
J1 = SAMTEC_LPAM-40-01.0-S-08-2-K: Connector 320 Male contacts in 8 row abcdef; Part Description: 320 Contacts (8x40), Pitch 1.27mm, Straight High Speed Low-Profile Open-Pin-Field Header; Manufacturer: SAMTEC; PressFit: No; Sense Comment: Solder Paste Deposition Sensitive – Check Manufacturer Recommendations for Stencil Design; Part Number: SAMTEC_LPAM-40-01.0-S-08-2-K; Component Kind: Standard; Component Type: Standard; Pin Count: 320; Mounted: Yes; Socket: No; SMD: Yes; Sense: Yes; Status: None; Manufacturer Part Number: LPAM-40-01.0-S-08-2-K; ComponentHeight: 3.68mm; HelpURL: \\cern.ch\dfs\Applications\Altium\Datasheets\SAMTEC_LPAM-40-01.0-S-08-2-K.pdf; Author: CERN DEM BC; CreateDate: 31.01.2020; LatestRevisionDate: 31.01.2020